# Altium schematic sheet MCU_ATmega4809.SchDoc
size A; DocumentNumber: 4; SheetNumber: 4; SheetTotal: 5
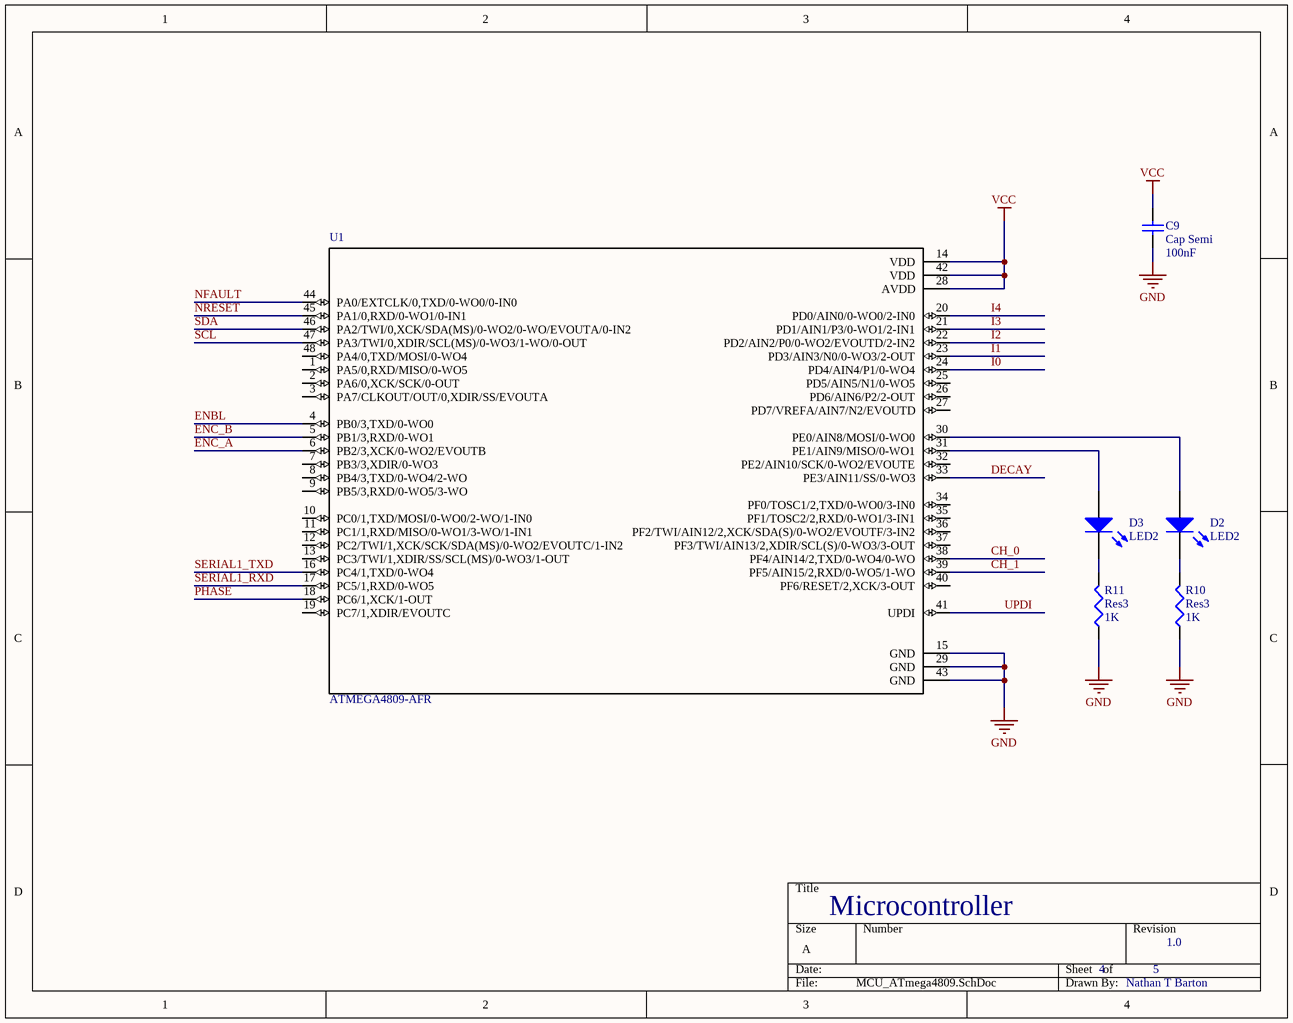
[diagram p0: MCU_ATmega4809.SchDoc]

## Parts
C9  Cap Semi  value 100nF  [C1206]
D2  LED2  [3.2X1.6X1.1]
D3  LED2  [3.2X1.6X1.1]
R10  Res3  value 1K  [J1-0603]
R11  Res3  value 1K  [J1-0603]
U1  ATMEGA4809-AFR  [*QFP50P900X900X120-48N]

## Nets
GND: C9.1 R10.1 R11.1 U1.15(GND) U1.29(GND) U1.43(GND)
VCC: C9.2 U1.14(VDD) U1.28(AVDD) U1.42(VDD)
CH_0: U1.38(PF4/AIN14/2,TXD/0-WO4/0-WO)
CH_1: U1.39(PF5/AIN15/2,RXD/0-WO5/1-WO)
DECAY: U1.33(PE3/AIN11/SS/0-WO3)
ENBL: U1.4(PB0/3,TXD/0-WO0)
ENC_A: U1.6(PB2/3,XCK/0-WO2/EVOUTB)
ENC_B: U1.5(PB1/3,RXD/0-WO1)
I0: U1.24(PD4/AIN4/P1/0-WO4)
I1: U1.23(PD3/AIN3/N0/0-WO3/2-OUT)
I2: U1.22(PD2/AIN2/P0/0-WO2/EVOUTD/2-IN2)
I3: U1.21(PD1/AIN1/P3/0-WO1/2-IN1)
I4: U1.20(PD0/AIN0/0-WO0/2-IN0)
NFAULT: U1.44(PA0/EXTCLK/0,TXD/0-WO0/0-IN0)
NRESET: U1.45(PA1/0,RXD/0-WO1/0-IN1)
PHASE: U1.18(PC6/1,XCK/1-OUT)
SCL: U1.47(PA3/TWI/0,XDIR/SCL(MS)/0-WO3/1-WO/0-OUT)
SDA: U1.46(PA2/TWI/0,XCK/SDA(MS)/0-WO2/0-WO/EVOUTA/0-IN2)
SERIAL1_RXD: U1.17(PC5/1,RXD/0-WO5)
SERIAL1_TXD: U1.16(PC4/1,TXD/0-WO4)
UPDI: U1.41(UPDI)
NetD2_1: D2.1(A) U1.30(PE0/AIN8/MOSI/0-WO0)
NetD2_2: D2.2(K) R10.2
NetD3_1: D3.1(A) U1.31(PE1/AIN9/MISO/0-WO1)
NetD3_2: D3.2(K) R11.2

Not connected (* = marked no-connect by the designer): U1 1(PA5/0,RXD/MISO/0-WO5) 2(PA6/0,XCK/SCK/0-OUT) 3(PA7/CLKOUT/OUT/0,XDIR/SS/EVOUTA) 7(PB3/3,XDIR/0-WO3) 8(PB4/3,TXD/0-WO4/2-WO) 9(PB5/3,RXD/0-WO5/3-WO) 10(PC0/1,TXD/MOSI/0-WO0/2-WO/1-IN0) 11(PC1/1,RXD/MISO/0-WO1/3-WO/1-IN1) 12(PC2/TWI/1,XCK/SCK/SDA(MS)/0-WO2/EVOUTC/1-IN2) 13(PC3/TWI/1,XDIR/SS/SCL(MS)/0-WO3/1-OUT) 19(PC7/1,XDIR/EVOUTC) 25(PD5/AIN5/N1/0-WO5) 26(PD6/AIN6/P2/2-OUT) 27(PD7/VREFA/AIN7/N2/EVOUTD) 32(PE2/AIN10/SCK/0-WO2/EVOUTE) 34(PF0/TOSC1/2,TXD/0-WO0/3-IN0) 35(PF1/TOSC2/2,RXD/0-WO1/3-IN1) 36(PF2/TWI/AIN12/2,XCK/SDA(S)/0-WO2/EVOUTF/3-IN2) 37(PF3/TWI/AIN13/2,XDIR/SCL(S)/0-WO3/3-OUT) 40(PF6/RESET/2,XCK/3-OUT) 48(PA4/0,TXD/MOSI/0-WO4)

## Notes on the sheet
- Microcontroller
- 4
- 5
- 1.0
- Nathan T Barton

## Library data of the parts
C9 = Cap Semi: Capacitor (Semiconductor SIM Model); Published: 8-Jun-2000; LatestRevisionDate: 29-May-2009; LatestRevisionNote: IPC-7351 Footprint Added.; PackageReference: C1206; Publisher: Altium Limited; PackageDescription: Chip Capacitor
D2 D3 = LED2: Typical RED, GREEN, YELLOW, AMBER GaAs LED; Published: 8-Jun-2000; LatestRevisionDate: 17-Jul-2002; LatestRevisionNote: Re-released for DXP Platform.; PackageVersion: Feb-2002; PackageReference: 3.2X1.6X1.1; Publisher: Altium Limited; PackageDescription: SM LED; 2 Flat Leads
R10 R11 = Res3: Resistor; Published: 8-Jun-2000; LatestRevisionDate: 29-May-2009; LatestRevisionNote: IPC-7351 Footprint Added.; PackageReference: J1-0603; Publisher: Altium Limited; PackageDescription: Chip Resistor
U1 = ATMEGA4809-AFR: 20MHz 48KB TQFP48 Ind 125C Green T&R; MF: Microchip; Package: TQFP-48 Microchip; Price: None; Availability: Unavailable; MP: ATMEGA4809-AFR; SnapEDA_Link: https://www.snapeda.com/parts/ATMEGA4809-AFR/Microchip/view-part/?ref=snap; Value: *